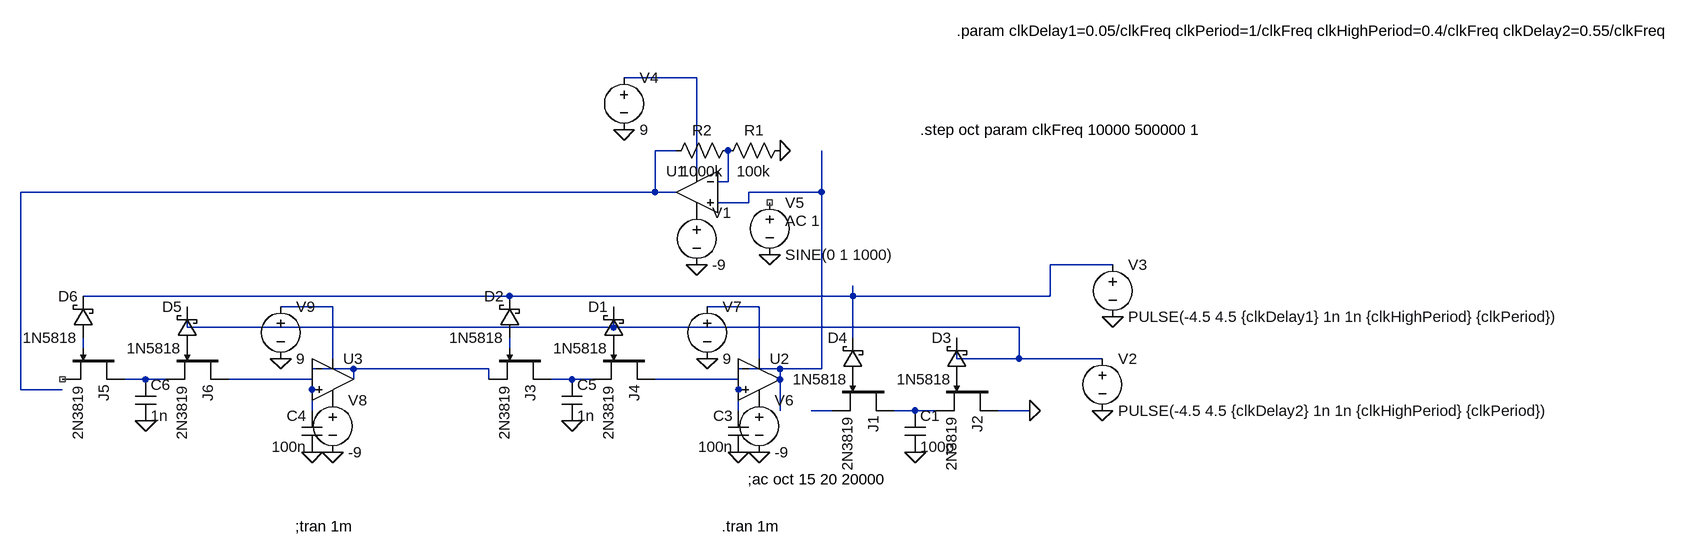
[diagram p0: schematic switchedCap.asc]
switchedCap.asc, the LTspice schematic file:
Version 4
SHEET 1 1728 680
WIRE -96 -368 -208 -368
WIRE -128 -256 -160 -256
WIRE -96 -224 -96 -368
WIRE -48 -208 -48 -256
WIRE -48 -208 -64 -208
WIRE -160 -192 -160 -256
WIRE -160 -192 -1136 -192
WIRE -128 -192 -160 -192
WIRE 96 -192 96 -256
WIRE 96 -192 -16 -192
WIRE -16 -176 -16 -192
WIRE -16 -176 -64 -176
WIRE 544 -80 448 -80
WIRE -384 -32 -1040 -32
WIRE 144 -32 144 -48
WIRE 144 -32 -384 -32
WIRE 448 -32 448 -80
WIRE 448 -32 144 -32
WIRE -656 -16 -736 -16
WIRE 0 -16 -80 -16
WIRE -880 16 -880 -16
WIRE -224 16 -224 -16
WIRE -224 16 -880 16
WIRE 400 16 -224 16
WIRE 144 32 144 -32
WIRE -1040 48 -1040 32
WIRE -384 48 -384 32
WIRE -656 64 -656 -16
WIRE 0 64 0 -16
WIRE 304 64 304 32
WIRE 400 64 400 16
WIRE 400 64 304 64
WIRE 528 64 400 64
WIRE -624 80 -688 80
WIRE -416 80 -624 80
WIRE 32 80 -32 80
WIRE 96 80 96 -192
WIRE 96 80 32 80
WIRE -944 96 -976 96
WIRE -912 96 -944 96
WIRE -688 96 -816 96
WIRE -624 96 -624 80
WIRE -416 96 -416 80
WIRE -288 96 -320 96
WIRE -256 96 -288 96
WIRE -32 96 -160 96
WIRE 32 96 32 80
WIRE -1136 112 -1136 -192
WIRE -1072 112 -1136 112
WIRE -688 112 -688 96
WIRE -32 112 -32 96
WIRE -688 144 -688 112
WIRE -32 144 -32 112
WIRE 32 144 32 96
WIRE 112 144 80 144
WIRE 240 144 208 144
WIRE 272 144 240 144
WIRE 416 144 368 144
FLAG 240 208 0
FLAG 416 144 0
FLAG 528 144 0
FLAG 544 0 0
FLAG -288 160 0
FLAG -32 208 0
FLAG -208 -288 0
FLAG -96 -80 0
FLAG 16 -96 0
FLAG -80 64 0
FLAG 0 208 0
FLAG -944 160 0
FLAG -688 208 0
FLAG -736 64 0
FLAG -656 208 0
FLAG 32 -256 0
SYMBOL njf 208 96 R90
SYMATTR InstName J1
SYMATTR Value 2N3819
SYMBOL njf 368 96 R90
SYMATTR InstName J2
SYMATTR Value 2N3819
SYMBOL cap 224 144 R0
SYMATTR InstName C1
SYMATTR Value 100p
SYMBOL voltage 544 -96 R0
WINDOW 123 0 0 Left 0
WINDOW 39 0 0 Left 0
SYMATTR InstName V3
SYMATTR Value PULSE(-4.5 4.5 {clkDelay1} 1n 1n {clkHighPeriod} {clkPeriod})
SYMBOL cap -16 208 R180
WINDOW 0 24 56 Left 2
WINDOW 3 24 8 Left 2
SYMATTR InstName C3
SYMATTR Value 100n
SYMBOL njf -320 48 R90
SYMATTR InstName J3
SYMATTR Value 2N3819
SYMBOL njf -160 48 R90
SYMATTR InstName J4
SYMATTR Value 2N3819
SYMBOL cap -304 96 R0
SYMATTR InstName C5
SYMATTR Value 1n
SYMBOL Opamps\\UniversalOpamp2 -96 -192 M0
SYMATTR InstName U1
SYMBOL voltage -96 -176 R0
WINDOW 123 0 0 Left 0
WINDOW 39 0 0 Left 0
SYMATTR InstName V1
SYMATTR Value -9
SYMBOL voltage -208 -384 R0
WINDOW 123 0 0 Left 0
WINDOW 39 0 0 Left 0
SYMATTR InstName V4
SYMATTR Value 9
SYMBOL voltage 16 -192 R0
WINDOW 123 24 44 Left 2
WINDOW 39 0 0 Left 0
SYMATTR InstName V5
SYMATTR Value SINE(0 1 1000)
SYMATTR Value2 AC 1
SYMBOL schottky -208 48 R180
WINDOW 0 24 64 Left 2
WINDOW 3 24 0 Left 2
SYMATTR InstName D1
SYMATTR Value 1N5818
SYMATTR Description Diode
SYMATTR Type diode
SYMBOL schottky -368 32 R180
WINDOW 0 24 64 Left 2
WINDOW 3 24 0 Left 2
SYMATTR InstName D2
SYMATTR Value 1N5818
SYMATTR Description Diode
SYMATTR Type diode
SYMBOL schottky 320 96 R180
WINDOW 0 24 64 Left 2
WINDOW 3 24 0 Left 2
SYMATTR InstName D3
SYMATTR Value 1N5818
SYMATTR Description Diode
SYMATTR Type diode
SYMBOL schottky 160 96 R180
WINDOW 0 24 64 Left 2
WINDOW 3 24 0 Left 2
SYMATTR InstName D4
SYMATTR Value 1N5818
SYMATTR Description Diode
SYMATTR Type diode
SYMBOL voltage 528 48 R0
WINDOW 123 0 0 Left 0
WINDOW 39 0 0 Left 0
SYMATTR InstName V2
SYMATTR Value PULSE(-4.5 4.5 {clkDelay2} 1n 1n {clkHighPeriod} {clkPeriod})
SYMBOL Opamps\\UniversalOpamp2 0 96 R0
SYMATTR InstName U2
SYMBOL voltage 0 112 R0
WINDOW 123 0 0 Left 0
WINDOW 39 0 0 Left 0
SYMATTR InstName V6
SYMATTR Value -9
SYMBOL voltage -80 -32 R0
WINDOW 123 0 0 Left 0
WINDOW 39 0 0 Left 0
SYMATTR InstName V7
SYMATTR Value 9
SYMBOL res 48 -272 R90
WINDOW 0 0 56 VBottom 2
WINDOW 3 32 56 VTop 2
SYMATTR InstName R1
SYMATTR Value 100k
SYMBOL res -32 -272 R90
WINDOW 0 0 56 VBottom 2
WINDOW 3 32 56 VTop 2
SYMATTR InstName R2
SYMATTR Value 1000k
SYMBOL cap -672 208 R180
WINDOW 0 24 56 Left 2
WINDOW 3 24 8 Left 2
SYMATTR InstName C4
SYMATTR Value 100n
SYMBOL njf -976 48 R90
SYMATTR InstName J5
SYMATTR Value 2N3819
SYMBOL njf -816 48 R90
SYMATTR InstName J6
SYMATTR Value 2N3819
SYMBOL cap -960 96 R0
SYMATTR InstName C6
SYMATTR Value 1n
SYMBOL schottky -864 48 R180
WINDOW 0 24 64 Left 2
WINDOW 3 24 0 Left 2
SYMATTR InstName D5
SYMATTR Value 1N5818
SYMATTR Description Diode
SYMATTR Type diode
SYMBOL schottky -1024 32 R180
WINDOW 0 24 64 Left 2
WINDOW 3 24 0 Left 2
SYMATTR InstName D6
SYMATTR Value 1N5818
SYMATTR Description Diode
SYMATTR Type diode
SYMBOL Opamps\\UniversalOpamp2 -656 96 R0
SYMATTR InstName U3
SYMBOL voltage -736 -32 R0
WINDOW 123 0 0 Left 0
WINDOW 39 0 0 Left 0
SYMATTR InstName V9
SYMATTR Value 9
SYMBOL voltage -656 112 R0
WINDOW 123 0 0 Left 0
WINDOW 39 0 0 Left 0
SYMATTR InstName V8
SYMATTR Value -9
TEXT -18 250 Left 2 !;ac oct 15 20 20000
TEXT 304 -440 Left 2 !.param clkDelay1=0.05/clkFreq clkPeriod=1/clkFreq clkHighPeriod=0.4/clkFreq clkDelay2=0.55/clkFreq
TEXT -58 322 Left 2 !.tran 1m
TEXT 248 -288 Left 2 !.step oct param clkFreq 10000 500000 1
TEXT -714 322 Left 2 !;tran 1m

The netlist it stands for:
* switchedCap.asc
J1 N017 P001 N016 2N3819
J2 0 P002 N017 2N3819
C1 N017 0 100p
V3 N005 0 PULSE(-4.5 4.5 {clkDelay1} 1n 1n {clkHighPeriod} {clkPeriod})
C3 0 N015 100n
J3 N014 N010 N011 2N3819
J4 N015 P003 N014 2N3819
C5 N014 0 1n
XU1 N004 N003 N001 P004 N002 level.2 Avol=1Meg GBW=10Meg Slew=10Meg ilimit=25m rail=0 Vos=0 phimargin=45 en=0 enk=0 in=0 ink=0 Rin=500Meg  ; pins IN+ IN- V+ V- OUT
V1 P004 0 -9
V4 N001 0 9
V5 NC_01 0 SINE(0 1 1000) AC 1
D1 P003 N008 1N5818
D2 N010 N005 1N5818
D3 P002 N008 1N5818
D4 P001 N005 1N5818
V2 N008 0 PULSE(-4.5 4.5 {clkDelay2} 1n 1n {clkHighPeriod} {clkPeriod})
XU2 N015 N004 N007 P005 N004 level.2 Avol=1Meg GBW=10Meg Slew=10Meg ilimit=25m rail=0 Vos=0 phimargin=45 en=0 enk=0 in=0 ink=0 Rin=500Meg  ; pins IN+ IN- V+ V- OUT
V6 P005 0 -9
V7 N007 0 9
R1 0 N003 100k
R2 N003 N002 1000k
C4 0 N013 100n
J5 N012 N009 NC_02 2N3819
J6 N013 P006 N012 2N3819
C6 N012 0 1n
D5 P006 N008 1N5818
D6 N009 N005 1N5818
XU3 N013 N011 N006 P007 N011 level.2 Avol=1Meg GBW=10Meg Slew=10Meg ilimit=25m rail=0 Vos=0 phimargin=45 en=0 enk=0 in=0 ink=0 Rin=500Meg  ; pins IN+ IN- V+ V- OUT
V9 N006 0 9
V8 P007 0 -9
.model D D
.lib standard.dio
.model NJF NJF
.model PJF PJF
.lib standard.jft
;ac oct 15 20 20000
.param clkDelay1=0.05/clkFreq clkPeriod=1/clkFreq clkHighPeriod=0.4/clkFreq clkDelay2=0.55/clkFreq
.tran 1m
.step oct param clkFreq 10000 500000 1
;tran 1m
.lib UniversalOpamps2.sub
.backanno
.end